# Altium schematic sheet motor_driver.SchDoc
size A4
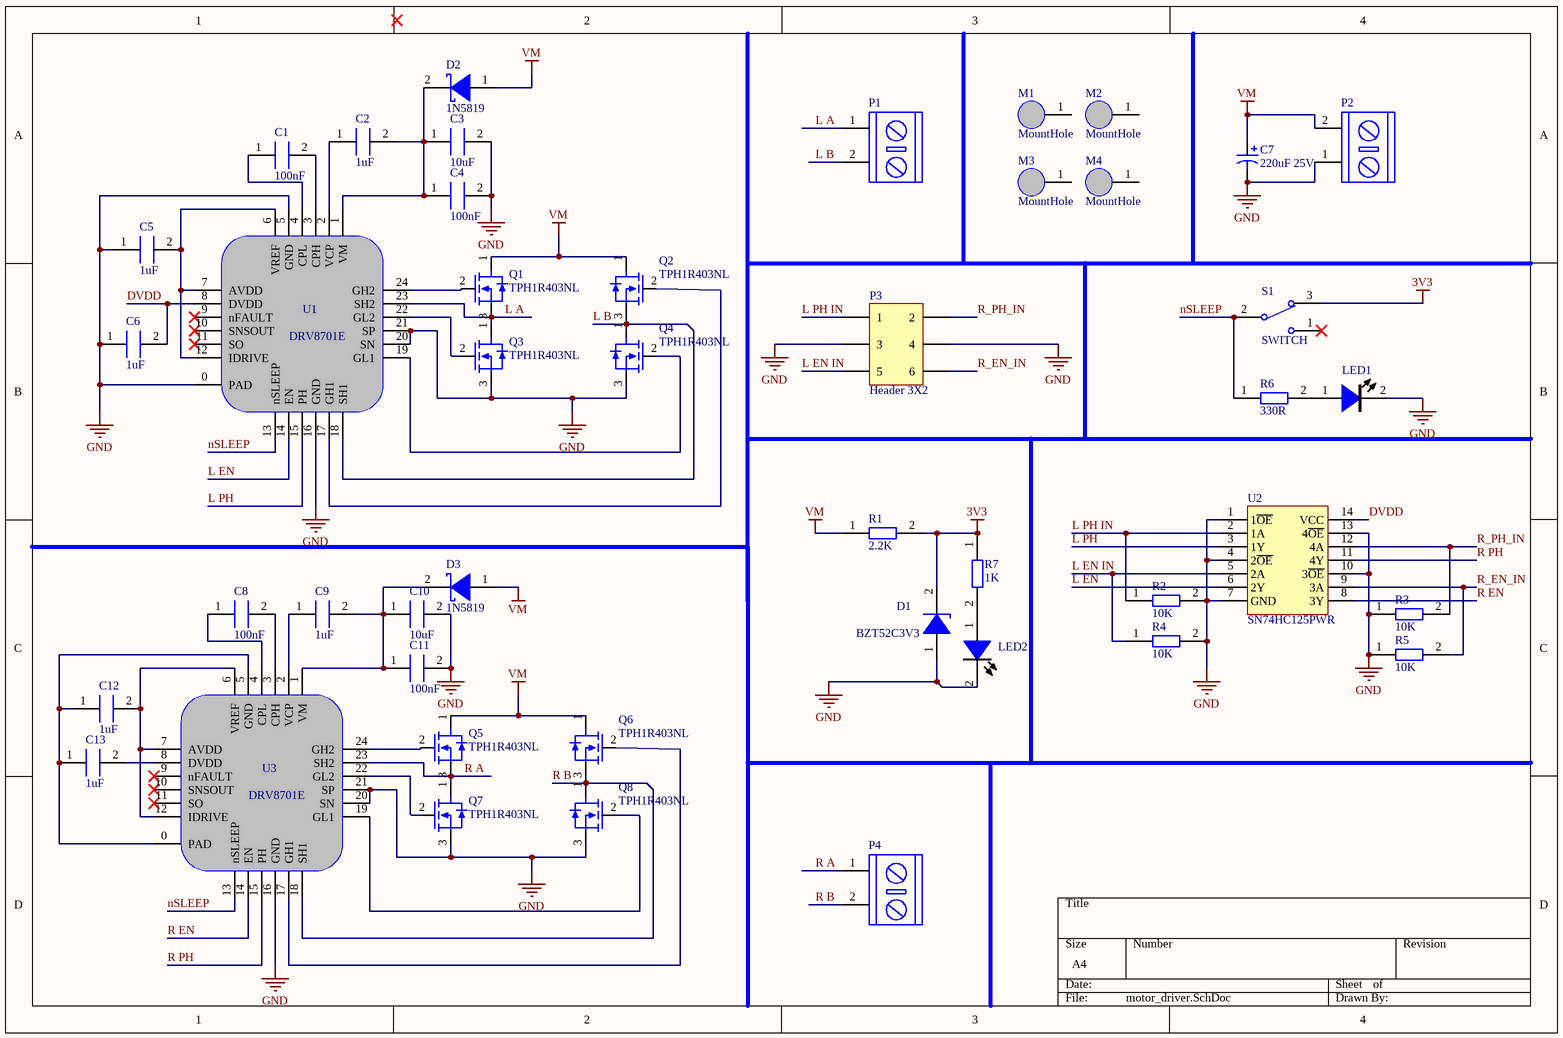
[diagram p0: motor_driver.SchDoc]

## Parts
C1  100nF  [C0603]
C2  1uF  [C0603]
C3  10uF  [C0805]
C4  100nF  [C0603]
C5  1uF  [C0603]
C6  1uF  [C0603]
C7  220uF 25V  [RB.2/.4]
C8  100nF  [C0603]
C9  1uF  [C0603]
C10  10uF  [C0805]
C11  100nF  [C0603]
C12  1uF  [C0603]
C13  1uF  [C0603]
D1  BZT52C3V3  [SOD-123]
D2  1N5819  [SOD-123]
D3  1N5819  [SOD-123]
LED1  LED  [LED-0805]  (value not drawn)
LED2  LED  [LED-0805]  (value not drawn)
M1  MountHole  [MountHole]
M2  MountHole  [MountHole]
M3  MountHole  [MountHole]
M4  MountHole  [MountHole]
P1  接口_1  [KF/WJ/DG 301-2p-5.0mm]  (value not drawn)
P2  接口  [KF/WJ/DG 301-2p-5.0mm]  (value not drawn)
P3  Header 3X2  [PIN-2x3-2.54-1.0]
P4  接口_1  [KF/WJ/DG 301-2p-5.0mm]  (value not drawn)
Q1  TPH1R403NL  [DFN5x6]
Q2  TPH1R403NL  [DFN5x6]
Q3  TPH1R403NL  [DFN5x6]
Q4  TPH1R403NL  [DFN5x6]
Q5  TPH1R403NL  [DFN5x6]
Q6  TPH1R403NL  [DFN5x6]
Q7  TPH1R403NL  [DFN5x6]
Q8  TPH1R403NL  [DFN5x6]
R1  2.2K  [0603]
R2  10K  [0603]
R3  10K  [0603]
R4  10K  [0603]
R5  10K  [0603]
R6  330R  [0603]
R7  1K  [0603]
S1  SWITCH  [ToggleSwitch 7102]
U1  DRV8701E  [QFN24-4x4]
U2  SN74HC125PWR  [TSSOP-14]
U3  DRV8701E  [QFN24-4x4]

## Nets
3V3: D1.2 R1.2 R7.1 S1.3
GND: C3.2 C4.2 C5.1 C6.1 C7.2 C10.2 C11.2 D1.1 LED1.2 LED2.2 P2.1 P3.3 P3.4 Q3.3 Q4.3 Q7.3 Q8.3 R2.2 R3.1 R4.2 R5.1 U1.0(PAD) U1.5(GND) U1.16(GND) U1.20(SN) U1.21(SP) U2.1(1~{OE}) U2.4(2~{OE}) U2.7(GND) U2.10(3~{OE}) U2.13(4~{OE}) U3.16(GND) U3.20(SN) U3.21(SP)
VM: C7.1 D2.1 D3.1 P2.2 Q1.1 Q2.1 Q5.1 Q6.1 R1.1
DVDD: C6.2 U1.8(DVDD) U2.14(VCC)
L A: P1.1 Q1.3 Q3.1 U1.23(SH2)
L B: P1.2 Q2.3 Q4.1 U1.18(SH1)
L EN: U1.14(EN) U2.6(2Y)
L EN IN: P3.5 R4.1 U2.5(2A)
L PH: U1.15(PH) U2.3(1Y)
L PH IN: P3.1 R2.1 U2.2(1A)
nSLEEP: R6.1 S1.2 U1.13(nSLEEP) U3.13(nSLEEP)
R A: P4.1 Q5.3 Q7.1 U3.23(SH2)
R B: P4.2 Q6.3 Q8.1 U3.18(SH1)
R EN: U2.8(3Y) U3.14(EN)
R PH: U2.11(4Y) U3.15(PH)
R_EN_IN: P3.6 R5.2 U2.9(3A)
R_PH_IN: P3.2 R3.2 U2.12(4A)
NetC1_1: C1.1 U1.4(CPL)
NetC1_2: C1.2 U1.3(CPH)
NetC2_1: C2.1 U1.2(VCP)
NetC2_2: C2.2 C3.1 C4.1 D2.2 U1.1(VM)
NetC5_2: C5.2 U1.6(VREF) U1.7(AVDD) U1.12(IDRIVE)
NetC8_1: C8.1 U3.4(CPL)
NetC8_2: C8.2 U3.3(CPH)
NetC9_1: C9.1 U3.2(VCP)
NetC9_2: C9.2 C10.1 C11.1 D3.2 U3.1(VM)
NetC12_1: C12.1 C13.1 U3.0(PAD) U3.5(GND)
NetC12_2: C12.2 U3.6(VREF) U3.7(AVDD) U3.12(IDRIVE)
NetC13_2: C13.2 U3.8(DVDD)
NetLED1_1: LED1.1 R6.2
NetLED2_1: LED2.1 R7.2
NetQ1_2: Q1.2 U1.24(GH2)
NetQ2_2: Q2.2 U1.17(GH1)
NetQ3_2: Q3.2 U1.22(GL2)
NetQ4_2: Q4.2 U1.19(GL1)
NetQ5_2: Q5.2 U3.24(GH2)
NetQ6_2: Q6.2 U3.17(GH1)
NetQ7_2: Q7.2 U3.22(GL2)
NetQ8_2: Q8.2 U3.19(GL1)

Not connected (* = marked no-connect by the designer): M1 1; M2 1; M3 1; M4 1; S1 1*; U1 9(nFAULT)* 10(SNSOUT)* 11(SO)*; U3 9(nFAULT)* 10(SNSOUT)* 11(SO)*

## Library data of the parts
C1-C6 C8-C13 = CAP: 电容
C7 = CAP_2
Q1-Q8 = TPH1R403NL: MOSFET
R1-R7 = RES: 电阻
U2 = SN74HC125PWR: IC